# Altium schematic sheet 主驱一体板1.5.SchDoc
size A4
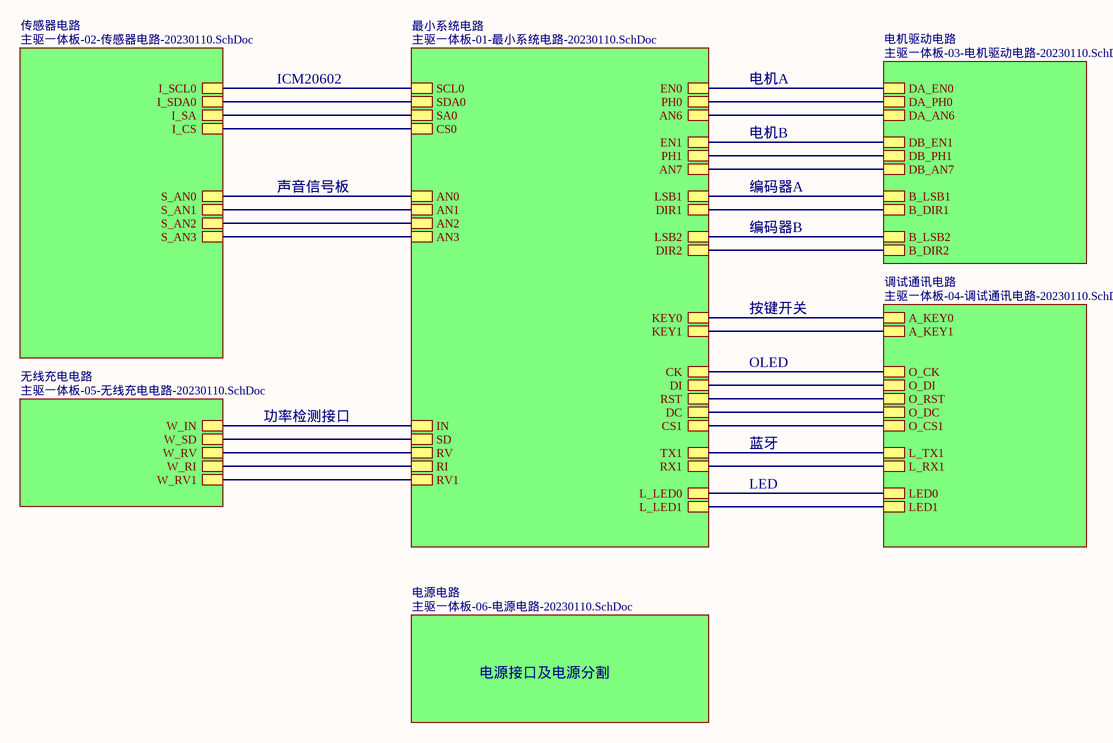
[diagram p0: 主驱一体板1.5.SchDoc]

## Sub-sheets
传感器电路 = 主驱一体板-02-传感器电路-20230110.SchDoc: I_CS, I_SA, I_SDA0, I_SCL0, S_AN0, S_AN1, S_AN2, S_AN3
无线充电电路 = 主驱一体板-05-无线充电电路-20230110.SchDoc: W_IN, W_SD, W_RV, W_RI, W_RV1
最小系统电路 = 主驱一体板-01-最小系统电路-20230110.SchDoc: SCL0, SDA0, SA0, CS0, LSB1, LSB2, DIR1, DIR2, AN0, AN1, AN2, AN3, KEY0, KEY1, CK, DI, RST, DC, CS1, EN0, EN1, PH0, PH1, AN6, AN7, IN, SD, RV, RI, RV1, TX1, RX1, L_LED0, L_LED1
电机驱动电路 = 主驱一体板-03-电机驱动电路-20230110.SchDoc: DA_EN0, DA_PH0, DB_EN1, DB_PH1, DA_AN6, DB_AN7, B_LSB1, B_LSB2, B_DIR1, B_DIR2
电源电路 = 主驱一体板-06-电源电路-20230110.SchDoc: no entries
调试通讯电路 = 主驱一体板-04-调试通讯电路-20230110.SchDoc: A_KEY0, A_KEY1, O_CK, O_DI, O_RST, O_DC, O_CS1, L_TX1, L_RX1, LED0, LED1

## Nets
(unnamed): sheet 最小系统电路/SCL0, sheet 传感器电路/I_SCL0
(unnamed): sheet 最小系统电路/SDA0, sheet 传感器电路/I_SDA0
(unnamed): sheet 最小系统电路/SA0, sheet 传感器电路/I_SA
(unnamed): sheet 最小系统电路/CS0, sheet 传感器电路/I_CS
(unnamed): sheet 最小系统电路/LSB1, sheet 电机驱动电路/B_LSB1
(unnamed): sheet 最小系统电路/LSB2, sheet 电机驱动电路/B_LSB2
(unnamed): sheet 最小系统电路/DIR1, sheet 电机驱动电路/B_DIR1
(unnamed): sheet 最小系统电路/DIR2, sheet 电机驱动电路/B_DIR2
(unnamed): sheet 最小系统电路/AN0, sheet 传感器电路/S_AN0
(unnamed): sheet 最小系统电路/AN1, sheet 传感器电路/S_AN1
(unnamed): sheet 最小系统电路/AN2, sheet 传感器电路/S_AN2
(unnamed): sheet 最小系统电路/AN3, sheet 传感器电路/S_AN3
(unnamed): sheet 最小系统电路/KEY0, sheet 调试通讯电路/A_KEY0
(unnamed): sheet 最小系统电路/KEY1, sheet 调试通讯电路/A_KEY1
(unnamed): sheet 最小系统电路/CK, sheet 调试通讯电路/O_CK
(unnamed): sheet 最小系统电路/DI, sheet 调试通讯电路/O_DI
(unnamed): sheet 最小系统电路/RST, sheet 调试通讯电路/O_RST
(unnamed): sheet 最小系统电路/DC, sheet 调试通讯电路/O_DC
(unnamed): sheet 最小系统电路/CS1, sheet 调试通讯电路/O_CS1
(unnamed): sheet 最小系统电路/EN0, sheet 电机驱动电路/DA_EN0
(unnamed): sheet 最小系统电路/EN1, sheet 电机驱动电路/DB_EN1
(unnamed): sheet 最小系统电路/PH0, sheet 电机驱动电路/DA_PH0
(unnamed): sheet 最小系统电路/PH1, sheet 电机驱动电路/DB_PH1
(unnamed): sheet 最小系统电路/AN6, sheet 电机驱动电路/DA_AN6
(unnamed): sheet 最小系统电路/AN7, sheet 电机驱动电路/DB_AN7
(unnamed): sheet 最小系统电路/IN, sheet 无线充电电路/W_IN
(unnamed): sheet 最小系统电路/SD, sheet 无线充电电路/W_SD
(unnamed): sheet 最小系统电路/RV, sheet 无线充电电路/W_RV
(unnamed): sheet 最小系统电路/RI, sheet 无线充电电路/W_RI
(unnamed): sheet 最小系统电路/RV1, sheet 无线充电电路/W_RV1
(unnamed): sheet 最小系统电路/TX1, sheet 调试通讯电路/L_TX1
(unnamed): sheet 最小系统电路/RX1, sheet 调试通讯电路/L_RX1
(unnamed): sheet 最小系统电路/L_LED0, sheet 调试通讯电路/LED0
(unnamed): sheet 最小系统电路/L_LED1, sheet 调试通讯电路/LED1

## Notes on the sheet
- ICM20602
- 电机A
- 电机B
- 声音信号板
- 编码器A
- 编码器B
- 按键开关
- OLED
- 功率检测接口
- 蓝牙
- LED
- 电源接口及电源分割